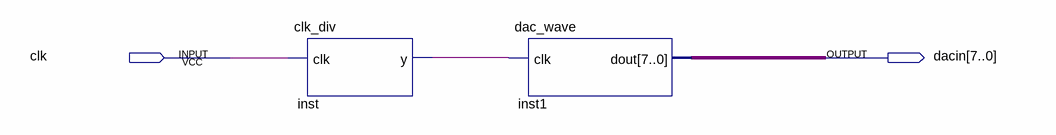
[diagram p0: schematic sheet]
// Quartus schematic DAC08.bdf as structural Verilog: 2 symbols, 2 pins
module DAC08 (
  input  clk,
  output [7:0] dacin
);

  wire inst_y;

  clk_div inst (.clk(clk), .y(inst_y));
  dac_wave inst1 (.clk(inst_y), .dout(dacin));
endmodule
